# EAGLE design CleanOpampBoostPedal (EAGLE 6.5.0)
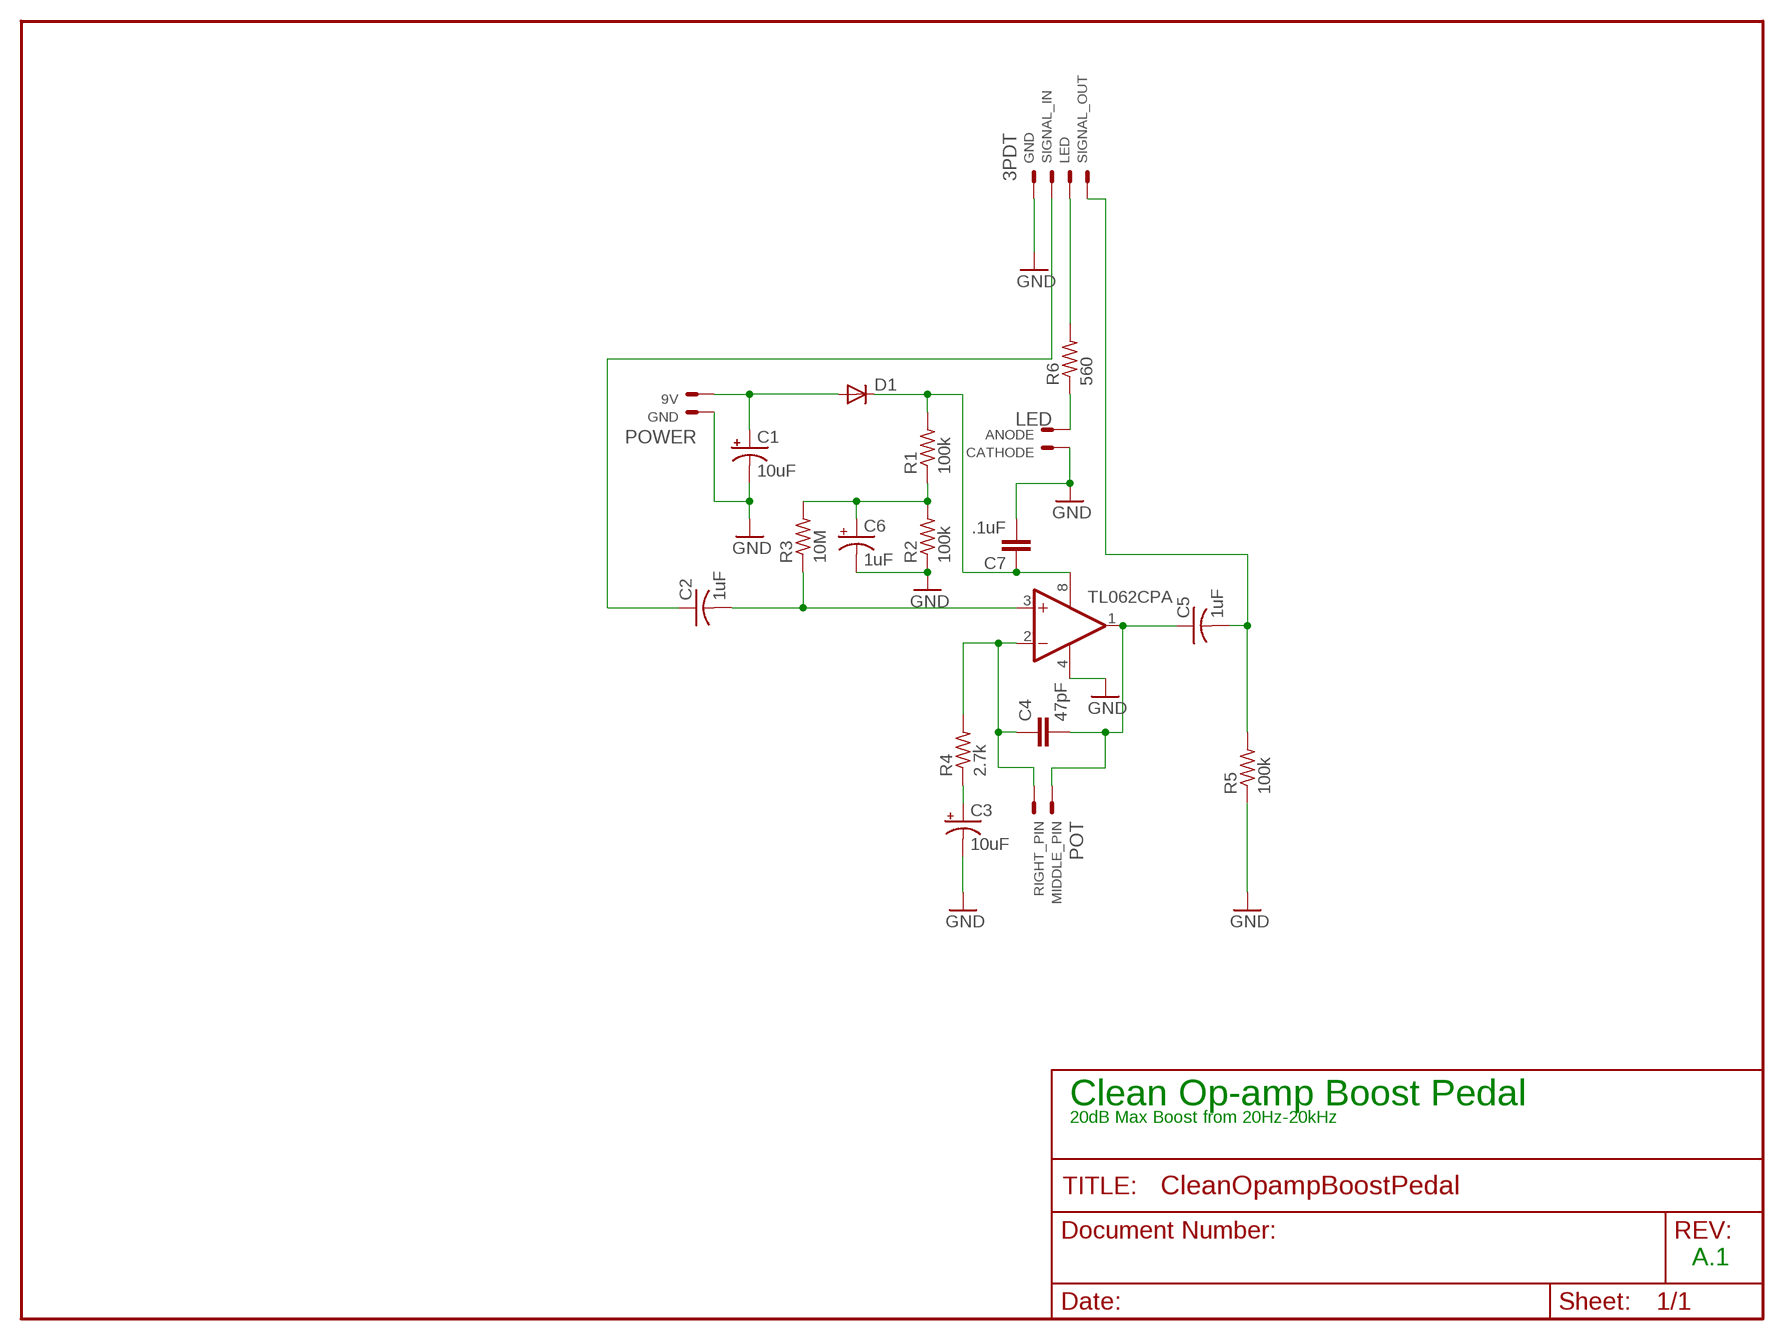
[diagram p0: schematic, sheet 1]

## Parts
3PDT  22-23-2041  [22-23-2041]
C1  10uF  CPOL-USE2,5-6E  [E2,5-6E]
C2  1uF  C-US050-045X075  [C050-045X075]
C3  10uF  CPOL-USE2,5-6E  [E2,5-6E]
C4  47pF  C2.5/2  [C2.5-2]
C5  1uF  C-US050-045X075  [C050-045X075]
C6  1uF  CPOL-USE2.5-6  [E2,5-6]
C7  .1uF  C2.5/2  [C2.5-2]
D1  DIODE-D-2.5  [D-2.5]
LED  22-23-2021  [22-23-2021]
POT  22-23-2021  [22-23-2021]
POWER  22-23-2021  [22-23-2021]
R1  100k  R-US_0207/2V  [0207/2V]
R2  100k  R-US_0207/2V  [0207/2V]
R3  10M  R-US_0207/2V  [0207/2V]
R4  2.7k  R-US_0207/2V  [0207/2V]
R5  100k  R-US_0207/2V  [0207/2V]
R6  560  R-US_0207/2V  [0207/2V]
TL062CP  LM1458N  [DIL08]

## Nets
GND: 3PDT.1 C1.- C3.- C6.- C7.2 LED.1 POWER.1 R2.1 R5.1 TL062CP.4(P:V-)
N$1: C2.2 R3.1 TL062CP.3(A:+IN)
N$2: 3PDT.3 R6.2
N$3: C7.1 D1.C R1.2 TL062CP.8(P:V+)
N$4: C1.+ D1.A POWER.2
N$5: LED.2 R6.1
N$6: C3.+ R4.1
N$7: C4.1 POT.2 R4.2 TL062CP.2(A:-IN)
N$8: C4.2 C5.1 POT.1 TL062CP.1(A:OUT)
N$9: 3PDT.4 C5.2 R5.2
N$10: 3PDT.2 C2.1
N$11: C6.+ R1.1 R2.2 R3.2
Unconnected: TL062CP.5(B:+IN) TL062CP.6(B:-IN) TL062CP.7(B:OUT)

## Notes on the sheet
- Clean Op-amp Boost Pedal
- 20dB Max Boost from 20Hz-20kHz
- A.1

## Library data of the parts
3PDT = con-molex:22-23-2041: .100" (2.54mm) Center Header - 4 Pin; TEMP: 3PDT
C1 C3 C6 = resistor:CPOL-US: POLARIZED CAPACITOR, American symbol
C2 C5 = resistor:C-US: CAPACITOR, American symbol
C4 C7 = capacitor-wima:C: CAPACITOR naming: grid - package width
D1 = diode:DIODE-: DIODE
LED POT POWER = con-molex:22-23-2021: .100" (2.54mm) Center Header - 2 Pin
R1-R6 = resistor:R-US_: RESISTOR, American symbol
TL062CP = linear:*1458: OP AMP

## Board
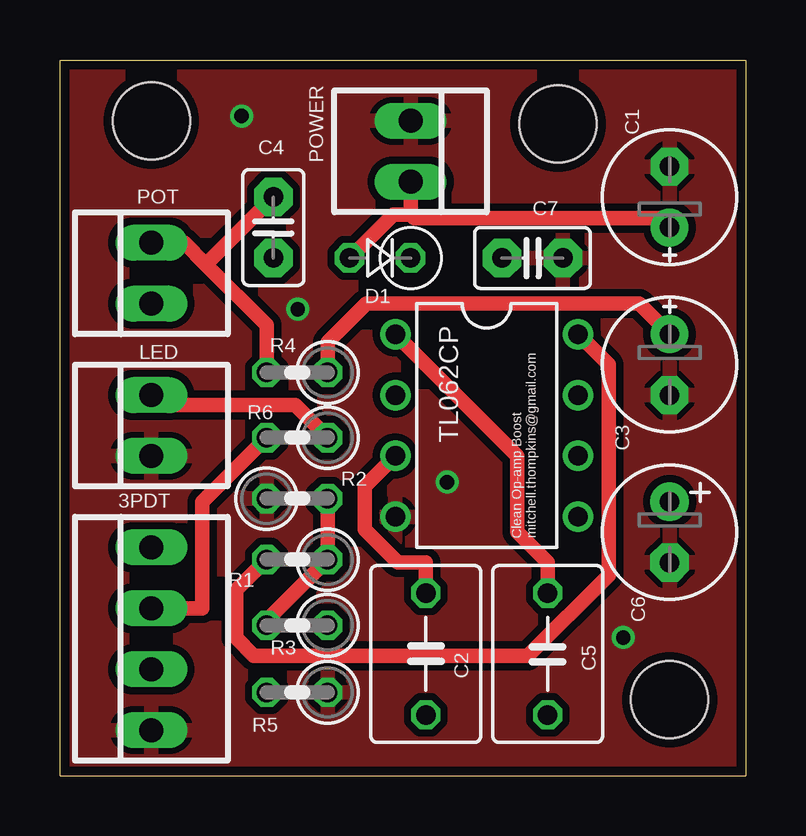
[diagram p1: board, top side]
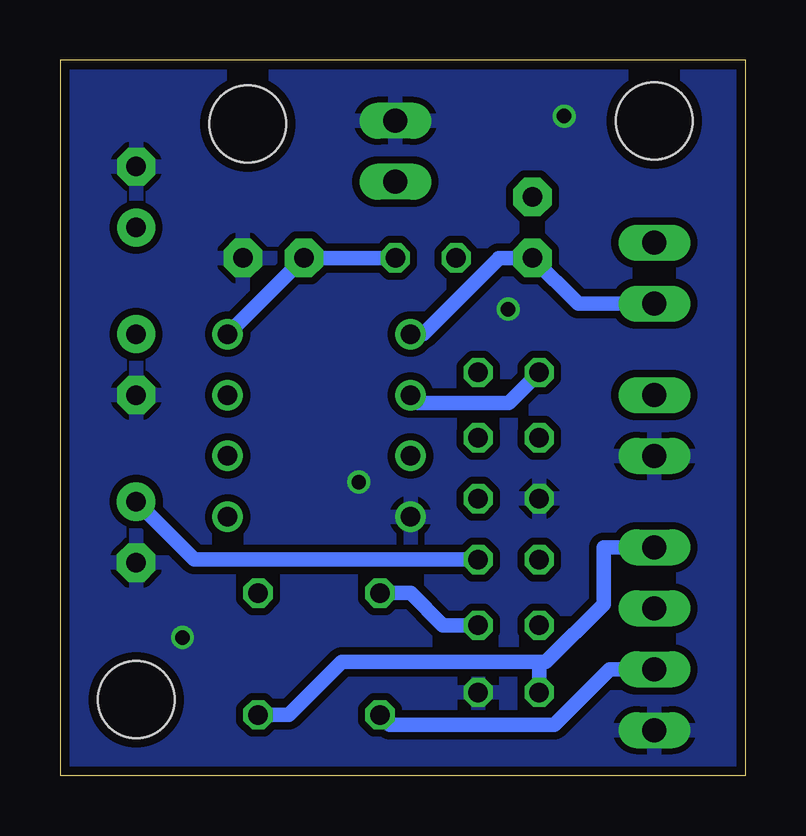
[diagram p2: board, bottom side, seen from below]

Size 28.57 x 29.84 mm. Coordinates in mm from the lower left corner, seen from the top.
Outline: 0,0 0,29.84 28.57,29.84 28.57,0 0,0
Copper layers (1*16): Top 0.0356mm / dielectric 1.5011mm / Bottom 0.0356mm
Design rules "Oshpark *": minimum track width 24mil, minimum drill 13mil, track to track 12mil, track to pad 12mil, pad to pad 12mil, via to via 12mil, smd to smd 12mil, copper to edge 15mil, drill to drill 6mil, minimum pad ring 7mil, minimum via ring 7mil, stop-mask expansion 3mil, vias tented up to drill 0mil, thermal gap 10mil
Holes 3.2 mm at 25.4,3.17 20.75,27.18 3.81,27.3

### Footprints (pad centres in the part's own frame; a part is rotated, then mirrored left to right if it is on the bottom)
22-23-2041 = drill 1 long: 1 -3.81,0; 2 -1.27,0; 3 1.27,0; 4 3.81,0
E2,5-6E = drill 0.813 pad 1.575: + -1.27,0 | drill 0.813 pad 1.575 octagon: - 1.27,0
C050-045X075 = drill 0.813 octagon: 1 -2.54,0; 2 2.54,0
C2.5-2 = drill 0.813 pad 1.6 octagon: 1 -1.27,0; 2 1.27,0
E2,5-6 = drill 0.813 pad 1.6: + -1.27,0 | drill 0.813 pad 1.6 octagon: - 1.27,0
D-2.5 = drill 0.813 octagon: A 1.27,0; C -1.27,0
22-23-2021 = drill 1 long: 1 -1.27,0; 2 1.27,0
0207/2V = drill 0.813 octagon: 1 -1.27,0; 2 1.27,0
DIL08 = drill 0.813 pad 1.27: 1 -3.81,-3.81; 2 -1.27,-3.81; 3 1.27,-3.81; 4 3.81,-3.81; 5 3.81,3.81; 6 1.27,3.81; 7 -1.27,3.81; 8 -3.81,3.81

### Placement (x,y rotation side)
3PDT  3.81,5.71 90 top
C1  25.4,24.13 90 top
C2  15.24,5.08 90 top
C3  25.4,17.14 270 top
C4  8.89,22.86 270 top
C5  20.32,5.08 270 top
C6  25.4,10.16 270 top
C7  19.68,21.59 0 top
D1  13.34,21.59 180 top
LED  3.81,14.61 90 top
POT  3.81,20.95 90 top
POWER  14.61,26.04 270 top
R1  9.88,9.02 180 top
R2  9.88,11.56 0 top
R3  9.88,6.27 180 top
R4  9.88,16.81 180 top
R5  9.88,3.48 180 top
R6  9.88,14.1 180 top
TL062CP  17.78,14.61 270 top

### Tracks (layer width: path | path; a pad name or v marks a point on that pad's centre or on a via)
GND  (via drill 0.6 pad 0.69)
  other vias: 7.57,27.51 9.91,19.46 23.47,5.77 16.13,12.24
  pour Top: 0,0 28.57,0 28.57,29.84 0,29.84
  pour Bottom: 0,29.84 28.57,29.84 28.57,0 0,0
N$1
  Top 0.61: C2.2 15.24,8.89 14.07,8.89 12.7,10.27 12.7,12.06 TL062CP.3
  Bottom 0.61: C2.2 13.97,7.62 12.62,6.27 R3.1
N$2
  Top 0.61: 3PDT.3 5.93,6.99 5.93,11.41 R6.2
N$3
  Top 0.61: TL062CP.8 22.86,17.14 22.86,8.36 19.5,5 8.08,5 7.34,5.74 7.34,7.75 R1.2
  Bottom 0.61: TL062CP.8 C7.1 15.88,21.59 D1.C
N$4
  Top 0.61: 14.61,23.4 14.77,23.24 25.02,23.24 C1.+ | 14.61,23.4 14.61,23.55 POWER.2 | 14.61,23.4 13.88,23.4 D1.A
N$5
  Top 0.61: R6.1 9.79,15.46 6.35,15.46 4.23,15.46 LED.2
N$6
  Top 0.61: R4.1 11.15,18.09 12.75,19.68 24.13,19.68 C3.+
N$7
  Top 0.61: 6.08,21.32 5.18,22.23 4.87,22.23 POT.2 | R4.2 8.61,18.79 6.08,21.32 | 6.08,21.32 C4.1
  Bottom 0.61: TL062CP.2 13.64,15.54 9.88,15.54 R4.2
N$8
  Top 0.61: C5.1 20.32,8.89 19.05,10.16 19.05,13.34 TL062CP.1
  Bottom 0.61: TL062CP.1 13.44,18.41 10.3,21.55 10.3,21.59 C4.2 6.99,19.68 POT.1
N$9
  Bottom 0.61: C5.2 19.05,2.54 16.84,4.75 8.61,4.75 | 3PDT.4 5.93,9.53 5.93,7.16 8.33,4.75 8.61,4.75 | R5.2 8.61,4.75
N$10
  Bottom 0.61: 3PDT.2 5.66,4.45 7.98,2.13 14.83,2.13 C2.1
N$11
  Top 0.61: R2.2 R1.1 8.61,6.48 R3.2
  Bottom 0.61: R1.1 22.99,9.02 C6.+

### Text on the board
tNames: Clean Op-amp Boost / mitchell.thompkins@gmail.com